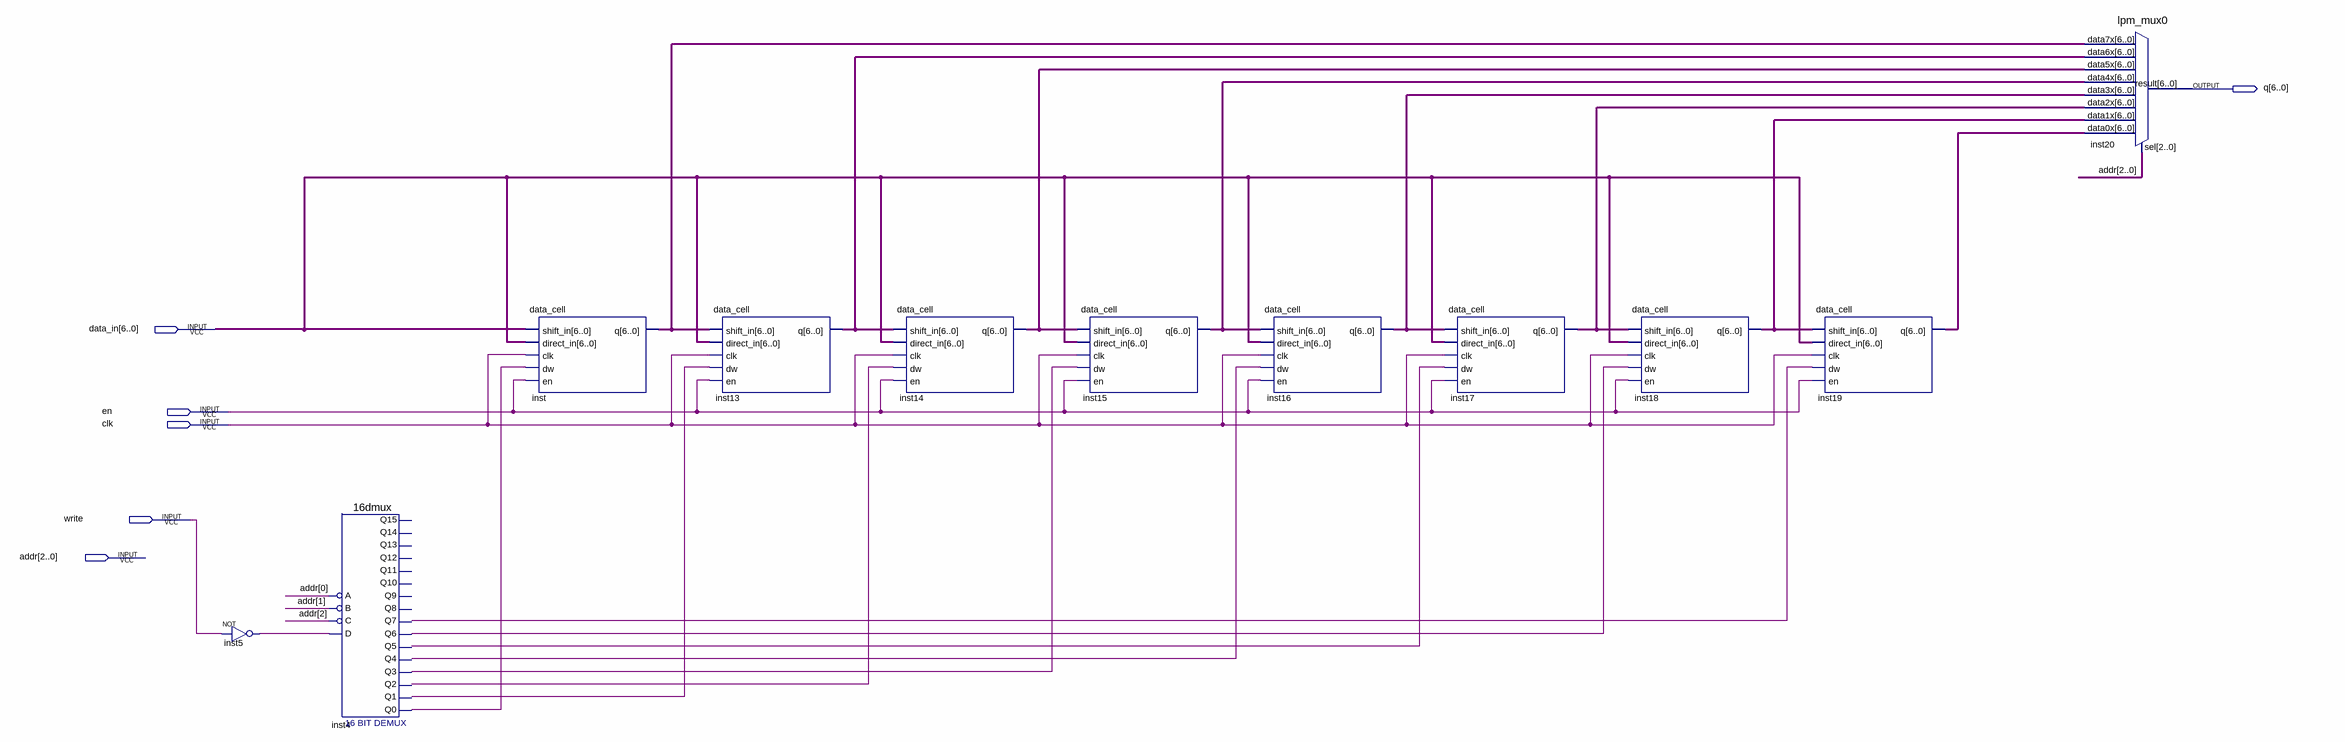
[diagram p0: schematic sheet]
// Quartus schematic data_line.bdf as structural Verilog: 11 symbols, 6 pins
module data_line (
  input  [6:0] data_in,
  input  en,
  input  clk,
  input  write,
  input  [2:0] addr,
  output [6:0] q
);

  wire inst4_q0, inst4_q1, inst4_q2, inst4_q3, inst4_q4, inst4_q5, inst4_q6, inst4_q7, inst5_out;
  wire [6:0] inst13_q, inst14_q, inst15_q, inst16_q, inst17_q, inst18_q, inst19_q, inst_q;

  not inst5 (inst5_out, write);
  \16dmux  inst4 (
    .C(~addr[2]), .B(~addr[1]), .A(~addr[0]), .D(inst5_out), .Q7(inst4_q7), .Q4(inst4_q4), .Q5(inst4_q5),
    .Q6(inst4_q6), .Q2(inst4_q2), .Q3(inst4_q3), .Q0(inst4_q0), .Q1(inst4_q1));  // open: Q12, Q13, Q11, Q9, Q10, Q8, Q14, Q15
  data_cell inst (.shift_in(data_in), .direct_in(data_in), .clk(clk), .dw(inst4_q0), .en(en), .q(inst_q));
  data_cell inst13 (.shift_in(inst_q), .direct_in(data_in), .clk(clk), .dw(inst4_q1), .en(en), .q(inst13_q));
  data_cell inst14 (.shift_in(inst13_q), .direct_in(data_in), .clk(clk), .dw(inst4_q2), .en(en), .q(inst14_q));
  data_cell inst15 (.shift_in(inst14_q), .direct_in(data_in), .clk(clk), .dw(inst4_q3), .en(en), .q(inst15_q));
  data_cell inst16 (.shift_in(inst15_q), .direct_in(data_in), .clk(clk), .dw(inst4_q4), .en(en), .q(inst16_q));
  data_cell inst17 (.shift_in(inst16_q), .direct_in(data_in), .clk(clk), .dw(inst4_q5), .en(en), .q(inst17_q));
  data_cell inst18 (.shift_in(inst17_q), .direct_in(data_in), .clk(clk), .dw(inst4_q6), .en(en), .q(inst18_q));
  data_cell inst19 (.shift_in(inst18_q), .direct_in(data_in), .clk(clk), .dw(inst4_q7), .en(en), .q(inst19_q));
  lpm_mux0 inst20 (
    .data7x(inst_q), .data6x(inst13_q), .data5x(inst14_q), .data4x(inst15_q), .data3x(inst16_q),
    .data2x(inst17_q), .data1x(inst18_q), .data0x(inst19_q), .sel(addr), .result(q));
endmodule
